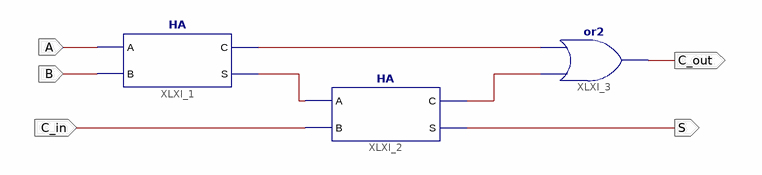
[diagram p0: schematic sheet 1]
// Xilinx ISE schematic FA.sch (spartan3e) as structural Verilog: 3 symbols, 5 ports
module FA (
  input  A,
  input  C_in,
  input  B,
  output S,
  output C_out
);

  wire XLXN_1, XLXN_8, XLXN_11;

  HA XLXI_1 (.A(A), .B(B), .C(XLXN_8), .S(XLXN_1));
  HA XLXI_2 (.A(XLXN_1), .B(C_in), .C(XLXN_11), .S(S));
  or XLXI_3 (C_out, XLXN_11, XLXN_8);
endmodule
